# EAGLE design sch3 (EAGLE 7.4.0)
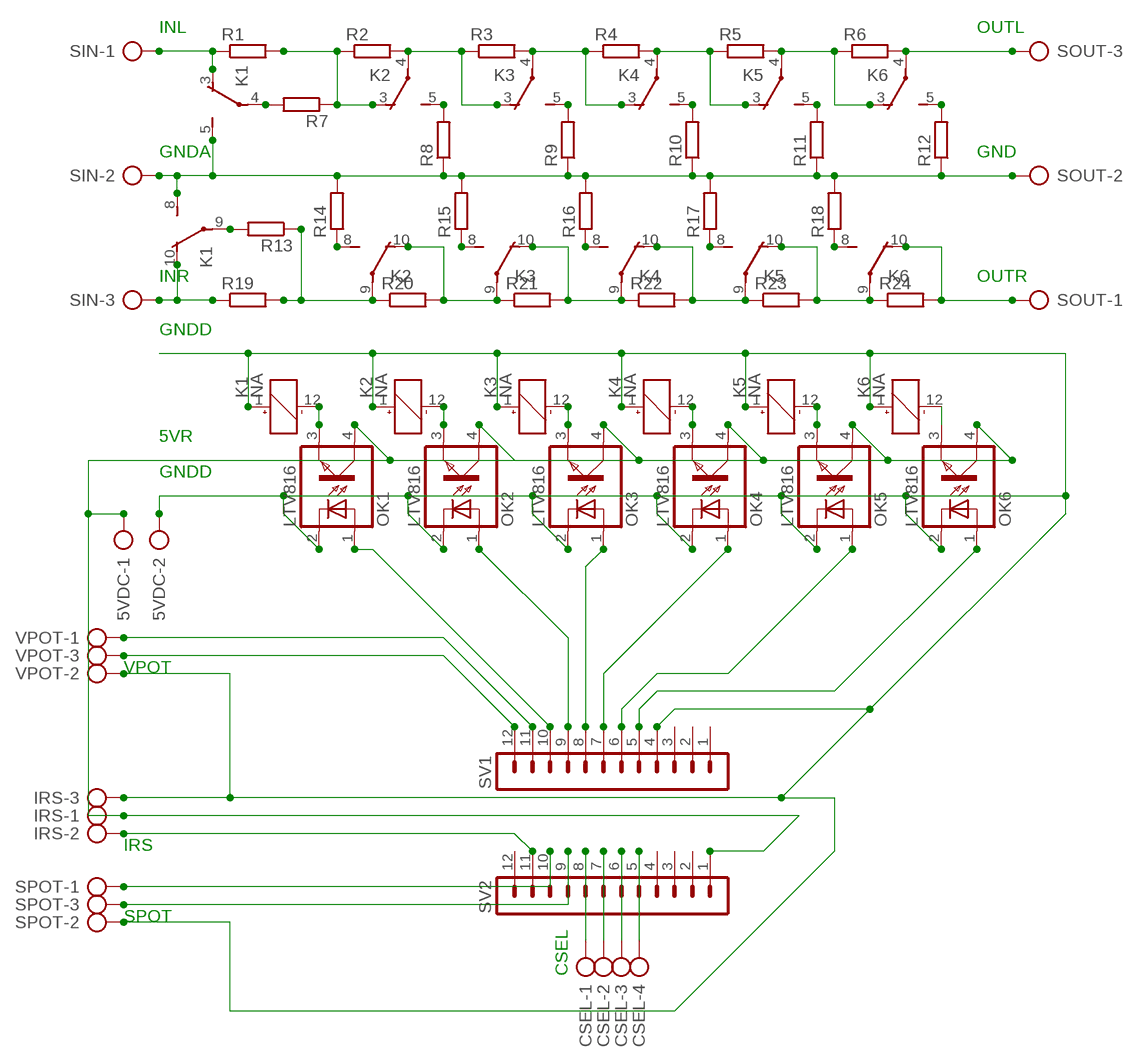
[diagram p0: schematic, sheet 1]

## Parts
5VDC  AK500/2  [AK500/2]
CSEL  AK500/4  [AK500/4]
IRS  AK500/3  [AK500/3]
K1  NA  [NA]
K2  NA  [NA]
K3  NA  [NA]
K4  NA  [NA]
K5  NA  [NA]
K6  NA  [NA]
OK1  LTV816  [DIL04]
OK2  LTV816  [DIL04]
OK3  LTV816  [DIL04]
OK4  LTV816  [DIL04]
OK5  LTV816  [DIL04]
OK6  LTV816  [DIL04]
R1  R-EU_0204/7  [0204/7]
R2  R-EU_0204/7  [0204/7]
R3  R-EU_0204/7  [0204/7]
R4  R-EU_0204/7  [0204/7]
R5  R-EU_0204/7  [0204/7]
R6  R-EU_0204/7  [0204/7]
R7  R-EU_0204/7  [0204/7]
R8  R-EU_0204/7  [0204/7]
R9  R-EU_0204/7  [0204/7]
R10  R-EU_0204/7  [0204/7]
R11  R-EU_0204/7  [0204/7]
R12  R-EU_0204/7  [0204/7]
R13  R-EU_0204/7  [0204/7]
R14  R-EU_0204/7  [0204/7]
R15  R-EU_0204/7  [0204/7]
R16  R-EU_0204/7  [0204/7]
R17  R-EU_0204/7  [0204/7]
R18  R-EU_0204/7  [0204/7]
R19  R-EU_0204/7  [0204/7]
R20  R-EU_0204/7  [0204/7]
R21  R-EU_0204/7  [0204/7]
R22  R-EU_0204/7  [0204/7]
R23  R-EU_0204/7  [0204/7]
R24  R-EU_0204/7  [0204/7]
SIN  AK500/3  [AK500/3]
SOUT  AK500/3  [AK500/3]
SPOT  AK500/3  [AK500/3]
SV1  MA12-1  [MA12-1]
SV2  MA12-1  [MA12-1]
VPOT  AK500/3  [AK500/3]

## Nets
GNDA: K1.5(2:S) K1.8(3:S) R8.1 R9.1 R10.1 R11.1 R12.1 R14.2 R15.2 R16.2 R17.2 R18.2 SIN.2 SOUT.2
GNDD: 5VDC.2 IRS.3 K1.1(1:+) K2.1(1:+) K3.1(1:+) K4.1(1:+) K5.1(1:+) K6.1(1:+) OK1.2(C) OK2.2(C) OK3.2(C) OK4.2(C) OK5.2(C) OK6.2(C) SPOT.2 SV1.4 VPOT.2
N$1: K2.3(2:O) R1.2 R2.1 R7.1
N$2: K2.4(2:P) K3.3(2:O) R2.2 R3.1
N$3: K3.4(2:P) K4.3(2:O) R3.2 R4.1
N$4: K4.4(2:P) K5.3(2:O) R4.2 R5.1
N$5: K5.4(2:P) K6.3(2:O) R5.2 R6.1
N$6: K6.4(2:P) R6.2 SOUT.3
N$7: K1.3(2:O) R1.1 SIN.1
N$8: K1.9(3:P) R13.2
N$9: K2.5(2:S) R8.2
N$10: K3.5(2:S) R9.2
N$11: K4.5(2:S) R10.2
N$12: K5.5(2:S) R11.2
N$13: K6.5(2:S) R12.2
N$14: K1.4(2:P) R7.2
N$15: K1.10(3:O) R19.1 SIN.3
N$16: K2.8(3:S) R14.1
N$17: K3.8(3:S) R15.1
N$18: K4.8(3:S) R16.1
N$19: K5.8(3:S) R17.1
N$20: K6.8(3:S) R18.1
N$21: SV1.11 VPOT.1
N$22: SV1.12 VPOT.3
N$23: K1.12(1:-) OK1.3(EMIT)
N$24: K2.12(1:-) OK2.3(EMIT)
N$25: K3.12(1:-) OK3.3(EMIT)
N$26: K4.12(1:-) OK4.3(EMIT)
N$27: K2.9(3:P) R13.1 R19.2 R20.1
N$28: K2.10(3:O) K3.9(3:P) R20.2 R21.1
N$29: K3.10(3:O) K4.9(3:P) R21.2 R22.1
N$30: K4.10(3:O) K5.9(3:P) R22.2 R23.1
N$31: K5.10(3:O) K6.9(3:P) R23.2 R24.1
N$32: K6.10(3:O) R24.2 SOUT.1
N$33: K5.12(1:-) OK5.3(EMIT)
N$34: K6.12(1:-) OK6.3(EMIT)
N$36: OK6.1(A) SV1.5
N$37: OK5.1(A) SV1.6
N$38: OK4.1(A) SV1.7
N$39: OK3.1(A) SV1.8
N$40: OK2.1(A) SV1.9
N$41: OK1.1(A) SV1.10
N$42: IRS.2 SV2.11
N$43: CSEL.1 SV2.8
N$44: CSEL.2 SV2.7
N$45: CSEL.3 SV2.6
N$46: CSEL.4 SV2.5
N$47: SPOT.1 SV2.10
N$48: SPOT.3 SV2.9
N$50: 5VDC.1 IRS.1 OK1.4(COL) OK2.4(COL) OK3.4(COL) OK4.4(COL) OK5.4(COL) OK6.4(COL) SV2.1
Unconnected: SV1.1 SV1.2 SV1.3 SV2.2 SV2.3 SV2.4 SV2.12

## Notes on the sheet
- INL | OUTL
- GNDA | GND
- INR | OUTR
- GNDD
- 5VR
- GNDD
- VPOT
- IRS
- SPOT
- CSEL

## Library data of the parts
5VDC = con-ptr500:AK500/2: CONNECTOR; OC_FARNELL: unknown; OC_NEWARK: unknown
CSEL = con-ptr500:AK500/4: CONNECTOR; OC_FARNELL: unknown; OC_NEWARK: unknown
IRS SIN SOUT SPOT VPOT = con-ptr500:AK500/3: CONNECTOR; OC_FARNELL: unknown; OC_NEWARK: unknown
K1-K6 = relay:NA: RELAY; OC_FARNELL: unknown; OC_NEWARK: unknown
OK1-OK6 = optocoupler:LTV816: OPTO COUPLER Source: LITEON, LTV816.pdf; OC_FARNELL: unknown; OC_NEWARK: unknown
R1-R24 = rcl:R-EU_: RESISTOR, European symbol
SV1 SV2 = con-lstb:MA12-1: PIN HEADER; OC_FARNELL: unknown; OC_NEWARK: unknown

## Board
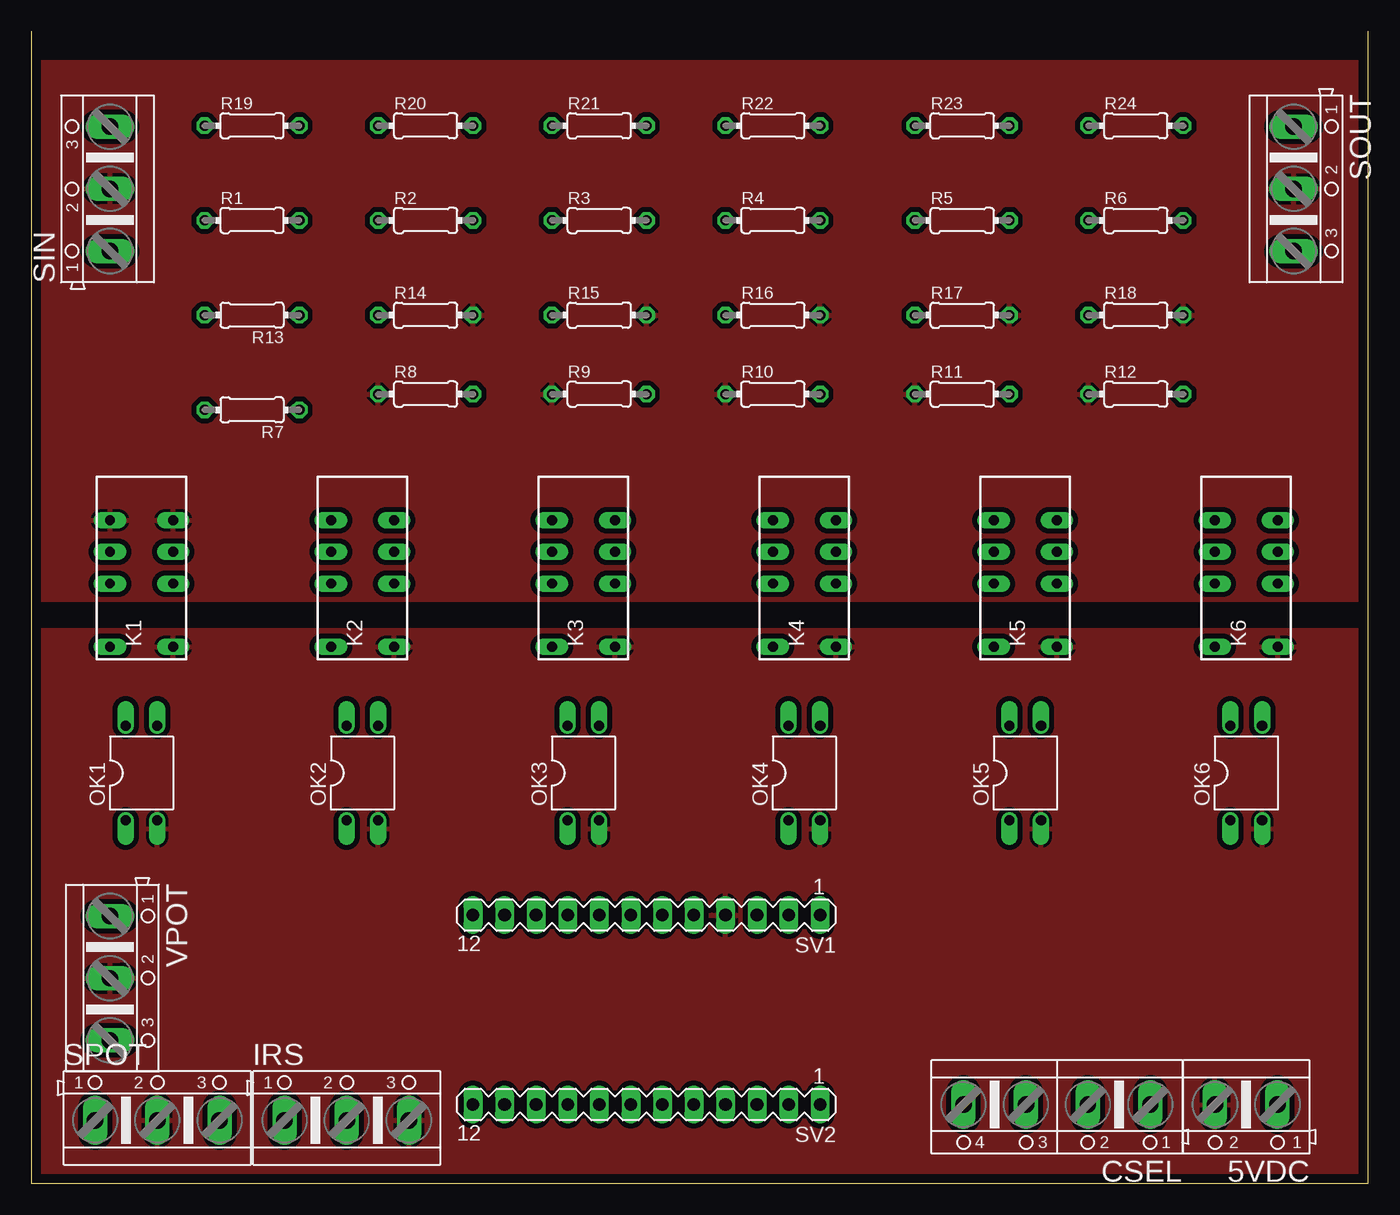
[diagram p1: board, top side]
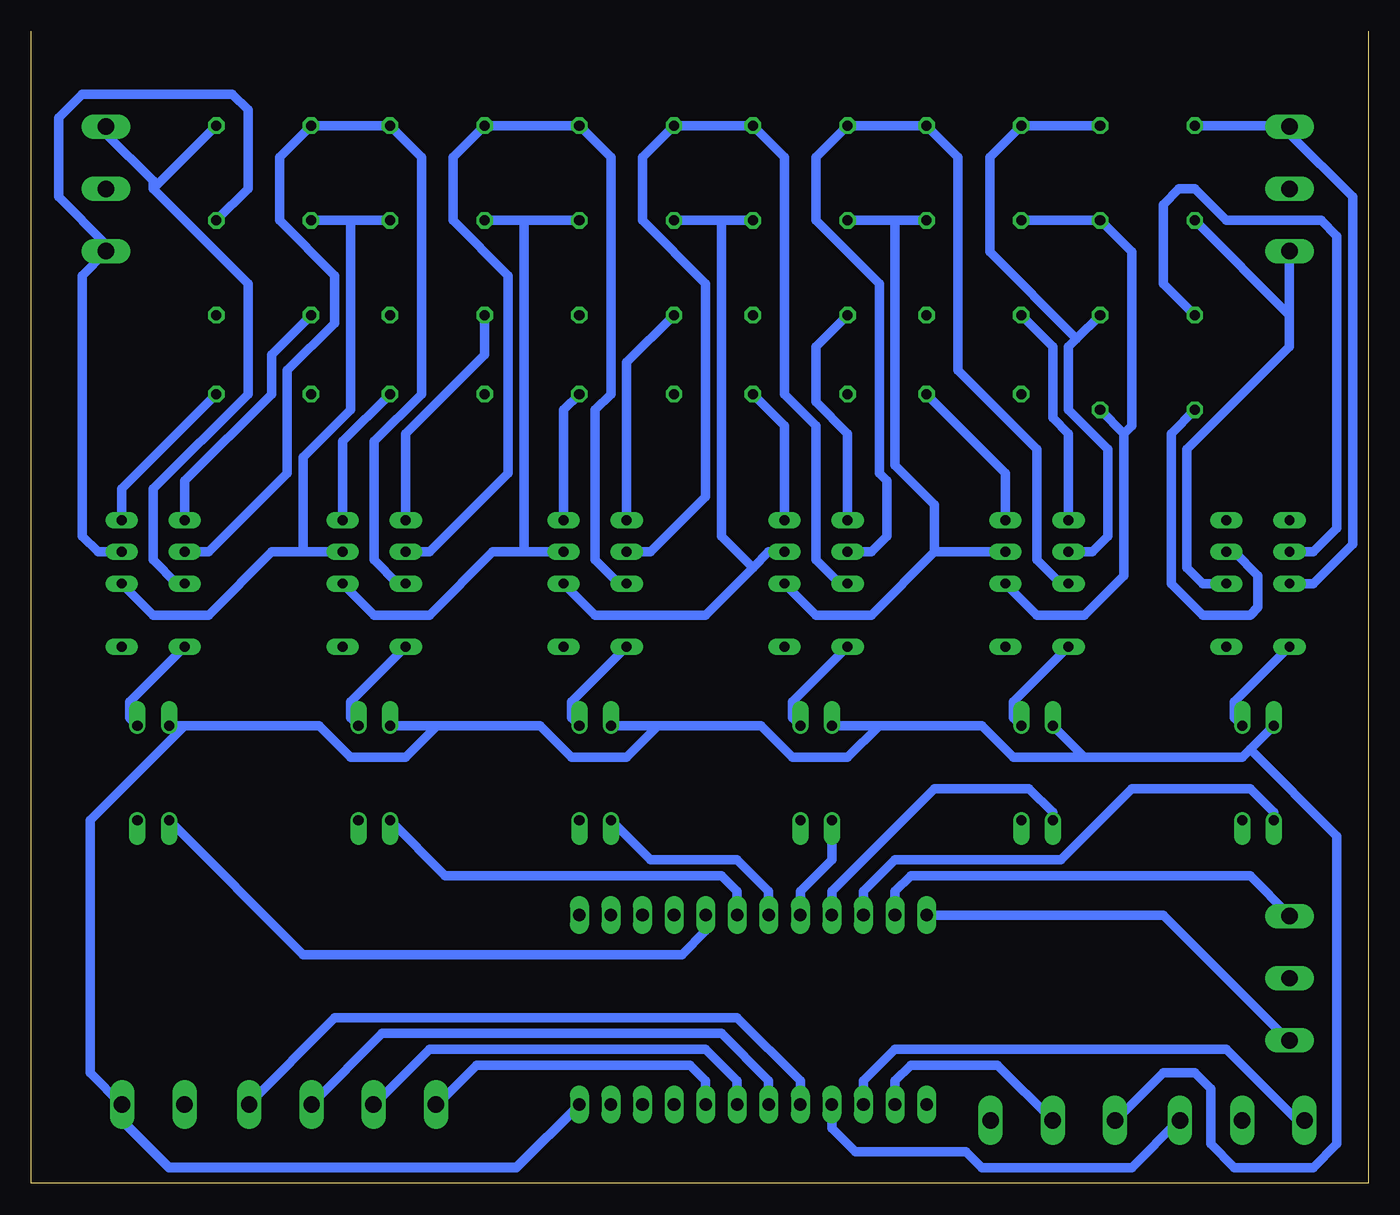
[diagram p2: board, bottom side, seen from below]

Size 107.62 x 92.7 mm. Coordinates in mm from the lower left corner, seen from the top.
Outline: 107.62,92.7 107.62,0 0,0 0,92.7
Copper layers (1*16): Top 0.035mm / dielectric 1.5mm / Bottom 0.035mm
Design rules "default *": minimum track width 30mil, minimum drill 24mil, track to track 16mil, track to pad 16mil, pad to pad 16mil, via to via 16mil, smd to smd 8mil, copper to edge 30mil, drill to drill 8mil, minimum pad ring 10mil, minimum via ring 8mil, stop-mask expansion 4mil, vias tented up to drill 0mil, thermal gap 10mil

### Footprints (pad centres in the part's own frame; a part is rotated, then mirrored left to right if it is on the bottom)
AK500/2 = drill 1.321 long: 1 -2.515,0; 2 2.515,0
AK500/4 = drill 1.321 long: 1 -7.518,0; 2 -2.489,0; 3 2.489,0; 4 7.518,0
AK500/3 = drill 1.321 long: 1 -5.004,0; 2 0,0; 3 5.004,0
NA = drill 0.8 long: 1 -6.35,-2.54; 3 -1.27,-2.54; 4 1.27,-2.54; 5 3.81,-2.54; 8 3.81,2.54; 9 1.27,2.54; 10 -1.27,2.54; 12 -6.35,2.54
DIL04 = drill 0.813 offset: 1 -1.27,-3.81; 2 1.27,-3.81; 3 1.27,3.81; 4 -1.27,3.81
0204/7 = drill 0.813 octagon: 1 -3.81,0; 2 3.81,0
MA12-1 = drill 1.016 long: 1 -13.97,0; 2 -11.43,0; 3 -8.89,0; 4 -6.35,0; 5 -3.81,0; 6 -1.27,0; 7 1.27,0; 8 3.81,0; 9 6.35,0; 10 8.89,0; 11 11.43,0; 12 13.97,0

### Placement (x,y rotation side)
5VDC  97.79,6.35 180 top
CSEL  82.55,6.35 180 top
IRS  25.4,5.08 0 top
K1  8.89,49.53 90 top
K2  26.67,49.53 90 top
K3  44.45,49.53 90 top
K4  62.23,49.53 90 top
K5  80.01,49.53 90 top
K6  97.79,49.53 90 top
OK1  8.89,33.02 0 top
OK2  26.67,33.02 0 top
OK3  44.45,33.02 0 top
OK4  62.23,33.02 0 top
OK5  80.01,33.02 0 top
OK6  97.79,33.02 0 top
R1  17.78,77.47 0 top
R2  31.75,77.47 0 top
R3  45.72,77.47 0 top
R4  59.69,77.47 0 top
R5  74.93,77.47 0 top
R6  88.9,77.47 0 top
R7  17.78,62.23 180 top
R8  31.75,63.5 0 top
R9  45.72,63.5 0 top
R10  59.69,63.5 0 top
R11  74.93,63.5 0 top
R12  88.9,63.5 0 top
R13  17.78,69.85 180 top
R14  31.75,69.85 0 top
R15  45.72,69.85 0 top
R16  59.69,69.85 0 top
R17  74.93,69.85 0 top
R18  88.9,69.85 0 top
R19  17.78,85.09 0 top
R20  31.75,85.09 0 top
R21  45.72,85.09 0 top
R22  59.69,85.09 0 top
R23  74.93,85.09 0 top
R24  88.9,85.09 0 top
SIN  6.35,80.01 90 top
SOUT  101.6,80.01 270 top
SPOT  10.16,5.08 0 top
SV1  49.53,21.59 180 top
SV2  49.53,6.35 180 top
VPOT  6.35,16.51 270 top

### Tracks (layer width: path | path; a pad name or v marks a point on that pad's centre or on a via)
GNDA
  pour Top: 0,90.17 0,46.99 107.95,46.99 107.95,90.17
GNDD
  Bottom 0.762: 55.83,21.54 SV1.4 55.88,20.95
  pour Top: 0,44.45 0,0 107.95,0 107.95,44.45
N$1
  Bottom 0.762: R2.1 R1.2 19.05,74.93 19.05,60.96 19.68,60.33 | K2.3 26.67,45.72 22.86,45.72 19.68,48.9 19.68,60.33 | R7.1 19.68,60.33
N$2
  Bottom 0.762: R3.1 38.1,77.47 | 38.1,77.47 R2.2 | 34.92,50.8 K2.4 | 34.92,50.8 40.01,45.72 44.45,45.72 K3.3 | 38.1,77.47 38.1,57.79 34.92,54.61 34.92,50.8
N$3
  Bottom 0.762: R4.1 52.07,77.47 | 52.07,77.47 R3.2 | K4.3 62.23,45.72 53.34,45.72 49.53,49.53 | 49.53,49.53 48.26,50.8 K3.4 | 52.07,77.47 52.07,52.07 49.53,49.53
N$4
  Bottom 0.762: R5.1 67.94,77.47 | 67.94,77.47 R4.2 | 67.94,50.8 70.48,50.8 75.56,45.72 80.01,45.72 K5.3 | 67.94,50.8 K4.4 | 67.94,50.8 67.94,77.47
N$5
  Bottom 0.762: R6.1 81.92,77.47 | 81.92,77.47 R5.2 | 85.72,50.8 88.27,50.8 93.34,45.72 97.79,45.72 K6.3 | 85.72,50.8 K5.4 | 81.92,77.47 81.92,62.23 85.72,58.42 85.72,50.8
N$6
  Bottom 0.762: K6.4 102.23,50.8 103.5,52.07 103.5,73.03 101.6,74.93 SOUT.3 101.6,75.56 105.41,79.38 105.41,85.73 103.5,87.63 91.44,87.63 90.17,86.36 90.17,80.01 R6.2
N$7
  Bottom 0.762: K1.3 13.34,48.26 14.61,49.53 14.61,59.05 6.35,67.31 6.35,69.85 | SIN.1 6.35,69.85 | 6.35,69.85 R1.1
N$8
  Bottom 0.762: K1.9 4.45,50.8 2.54,52.71 2.54,76.2 3.81,77.47 11.43,77.47 13.97,80.01 15.24,80.01 16.51,78.74 16.51,72.39 R13.2
N$9
  Bottom 0.762: K2.5 29.21,57.15 R8.2
N$10
  Bottom 0.762: K3.5 46.99,60.96 R9.2
N$11
  Bottom 0.762: K4.5 64.77,62.23 R10.2
N$12
  Bottom 0.762: K5.5 82.55,59.69 R11.2
N$13
  Bottom 0.762: K6.5 100.33,55.88 R12.2
N$14
  Bottom 0.762: K1.4 10.79,50.8 8.89,48.9 8.89,46.36 9.53,45.72 13.34,45.72 15.88,48.26 15.88,60.33 R7.2
N$15
  Bottom 0.762: K1.10 4.45,48.26 1.27,51.44 1.27,79.38 6.35,84.45 SIN.3 6.35,85.09 R19.1
N$16
  Bottom 0.762: K2.8 24.13,60.33 25.4,61.59 25.4,67.31 R14.1
N$17
  Bottom 0.762: K3.8 41.91,60.33 44.45,62.87 44.45,67.31 R15.1
N$18
  Bottom 0.762: K4.8 59.69,66.04 R16.1
N$19
  Bottom 0.762: K5.8 77.47,60.33 71.12,66.67 R17.1
N$20
  Bottom 0.762: K6.8 95.25,56.52 88.27,63.5 88.27,66.67 R18.1
N$21
  Bottom 0.762: SV1.11 38.1,23.49 36.83,24.76 9.53,24.76 6.35,21.59 VPOT.1
N$22
  Bottom 0.762: SV1.12 16.51,21.59 6.35,11.43 VPOT.3
N$23
  Bottom 0.762: K1.12 10.79,38.73 10.79,37.47 OK1.3
N$24
  Bottom 0.762: K2.12 28.57,38.73 28.57,37.47 OK2.3
N$25
  Bottom 0.762: K3.12 46.35,38.73 46.35,37.47 OK3.3
N$26
  Bottom 0.762: K4.12 64.14,38.73 64.14,37.47 OK4.3
N$27
  Bottom 0.762: R19.2 R20.1 30.48,82.55 30.48,74.93 23.5,67.95 | K2.9 22.23,50.8 20.95,52.07 20.95,59.05 24.13,62.23 24.13,67.31 23.5,67.95 | R13.1 23.5,67.95
N$28
  Bottom 0.762: K3.9 40.01,50.8 38.73,52.07 38.73,56.52 39.37,57.15 39.37,72.39 44.45,77.47 44.45,82.55 R21.1 R20.2 33.02,82.55 33.02,65.41 26.67,59.05 26.67,50.16 24.77,48.26 K2.10
N$29
  Bottom 0.762: K4.9 57.78,50.8 53.34,55.25 53.34,72.39 58.42,77.47 58.42,82.55 R22.1 R21.2 46.99,82.55 46.99,63.5 44.45,60.96 44.45,50.16 42.55,48.26 K3.10
N$30
  Bottom 0.762: K4.10 60.33,48.26 62.23,50.16 62.23,62.23 60.96,63.5 60.96,82.55 R22.2 R23.1 73.66,82.55 73.66,77.47 69.22,73.03 69.22,57.15 75.56,50.8 K5.9
N$31
  Bottom 0.762: K5.10 78.11,48.26 80.01,50.16 80.01,59.69 76.2,63.5 76.2,82.55 R23.2 R24.1 87.63,82.55 87.63,77.47 83.19,73.03 83.19,69.22 87,65.41 87,57.15 93.34,50.8 K6.9
N$32
  Bottom 0.762: K6.10 95.89,48.26 97.79,50.16 97.79,55.88 90.17,63.5 90.17,72.39 97.79,80.01 | 97.79,80.01 97.79,80.64 101.6,84.45 SOUT.1 | 97.79,80.01 R24.2
N$33
  Bottom 0.762: K5.12 81.92,38.73 81.92,37.47 OK5.3
N$34
  Bottom 0.762: K6.12 99.69,38.73 99.69,37.47 OK6.3
N$36
  Bottom 0.762: OK6.1 85.72,18.41 55.24,18.41 53.34,20.32 SV1.5
N$37
  Bottom 0.762: OK5.1 74.3,24.76 52.07,24.76 50.8,23.49 SV1.6
N$38
  Bottom 0.762: OK4.1 57.78,26.04 50.8,26.04 48.26,23.49 SV1.7
N$39
  Bottom 0.762: OK3.1 43.18,26.04 45.72,23.49 SV1.8
N$40
  Bottom 0.762: OK2.1 25.4,29.84 27.3,31.75 34.92,31.75 43.18,23.49 SV1.9
N$41
  Bottom 0.762: OK1.1 7.62,29.84 9.53,31.75 19.05,31.75 24.77,26.04 38.1,26.04 40.64,23.49 SV1.10
N$42
  Bottom 0.762: SV2.11 38.1,8.26 36.83,9.53 29.84,9.53 IRS.2
N$43
  Bottom 0.762: SV2.8 45.72,8.26 50.8,13.34 83.19,13.34 90.17,6.35 CSEL.1
N$44
  Bottom 0.762: SV2.7 48.26,8.26 52.07,12.07 79.38,12.07 85.09,6.35 CSEL.2
N$45
  Bottom 0.762: SV2.6 50.8,8.26 53.34,10.79 75.56,10.79 80.01,6.35 CSEL.3
N$46
  Bottom 0.762: SV2.5 53.34,8.26 54.61,9.53 71.75,9.53 74.93,6.35 CSEL.4
N$47
  Bottom 0.762: SV2.10 40.64,8.26 38.1,10.79 11.43,10.79 5.71,5.08 SPOT.1
N$48
  Bottom 0.762: SV2.9 43.18,4.45 41.27,2.54 32.38,2.54 31.11,1.27 19.05,1.27 15.24,5.08 SPOT.3
N$50
  Bottom 0.762: 9.53,34.92 10.16,34.29 22.86,34.29 | 9.53,34.92 OK1.4 | OK2.4 22.86,34.29 | 39.37,36.83 31.11,36.83 28.57,34.29 22.86,34.29 | 39.37,36.83 OK3.4 | 57.15,36.83 48.9,36.83 46.35,34.29 41.91,34.29 39.37,36.83 | 57.15,36.83 OK4.4 | 74.93,36.83 66.67,36.83 64.14,34.29 59.69,34.29 57.15,36.83 | 74.93,36.83 OK5.4 | 95.25,36.83 84.45,36.83 81.92,34.29 77.47,34.29 74.93,36.83 | 95.25,36.83 OK6.4 | 9.53,34.92 2.54,27.94 2.54,3.17 4.45,1.27 10.79,1.27 12.7,3.17 12.7,7.62 13.97,8.89 16.51,8.89 20.32,5.08 IRS.1 | 95.25,36.83 102.87,29.21 102.87,8.89 100.33,6.35 5VDC.1
  Bottom 0.813: SV2.1 68.58,1.27 96.52,1.27 100.33,5.08 100.33,6.35